# Altium schematic sheet Mynd_UI.SchDoc: Mynd-UI
size A3; Revision: 3.2; SheetNumber: 1; SheetTotal: 1
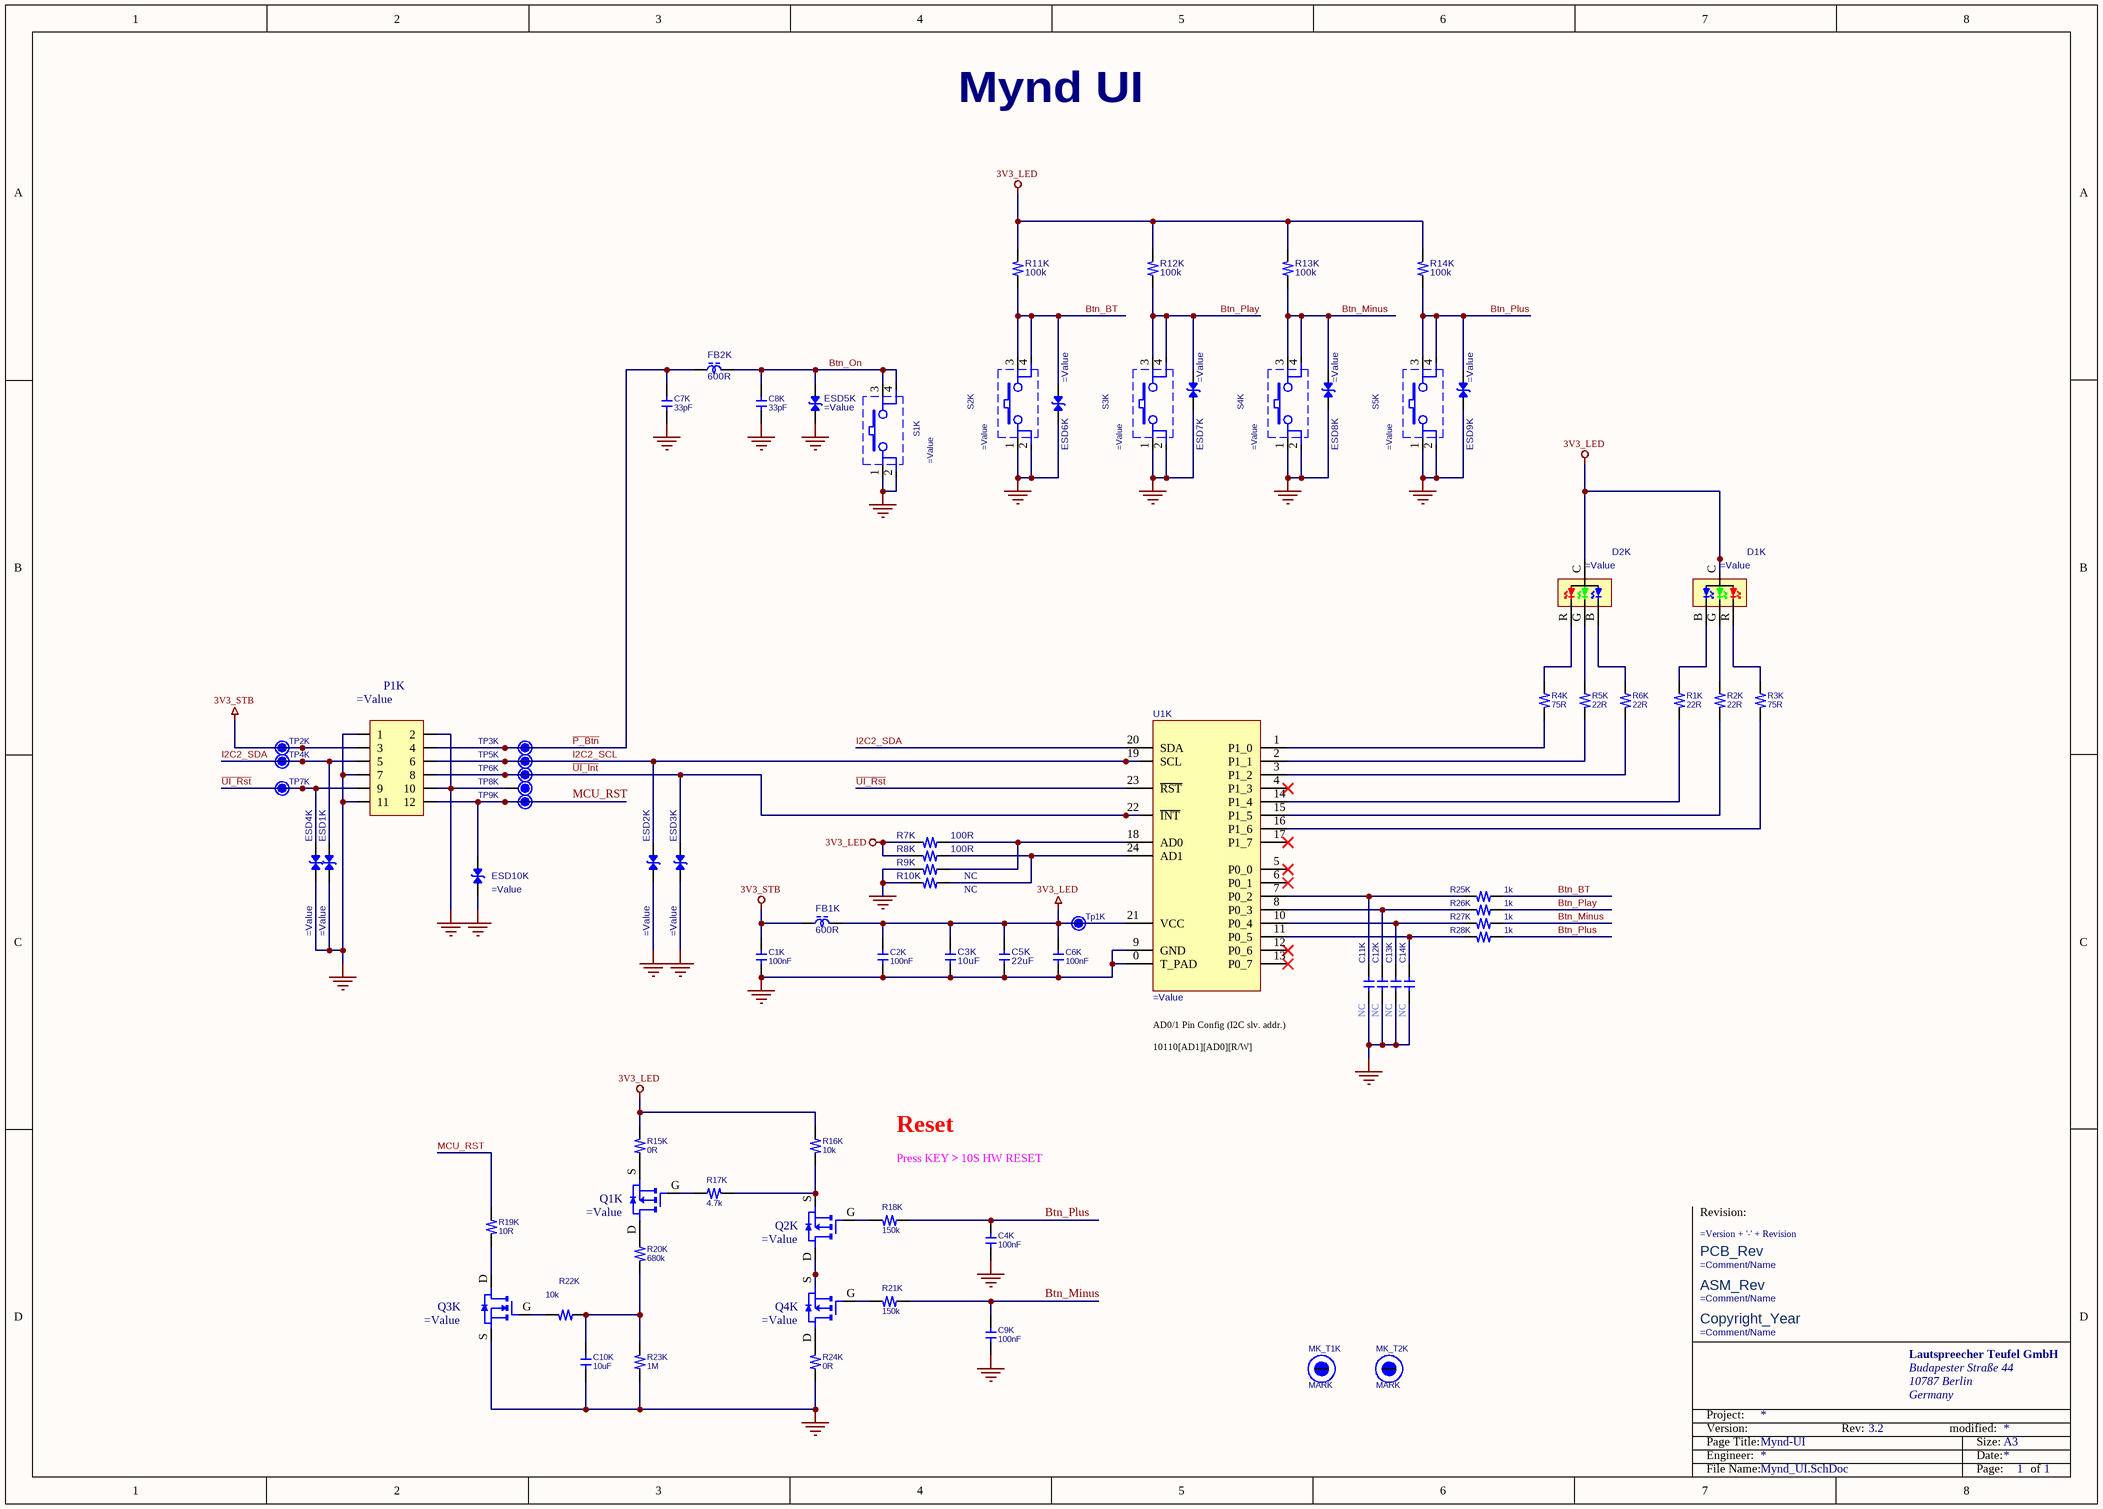
[diagram p0: Mynd_UI.SchDoc]

## Parts
C1K  100nF  [C0603X100]
C2K  100nF  [C0603X100]
C3K  10uF  [C0805_145]
C4K  100nF  [C0603X100]
C5K  22uF  [C1206]
C6K  100nF  [C0603X100]
C7K  33pF  [C0603X80]
C8K  33pF  [C0603X80]
C9K  100nF  [C0603X100]
C10K  10uF  [C0805_145]
C11K  NC  [C0603X100]  (value not drawn)
C12K  NC  [C0603X100]  (value not drawn)
C13K  NC  [C0603X100]  (value not drawn)
C14K  NC  [C0603X100]  (value not drawn)
D1K  (no value)  [LED_SMD_F_T_160X80X60]
D2K  (no value)  [LED_SMD_F_T_160X80X60]
ESD1K  (no value)  [DFN2_100X60X50_65]
ESD2K  (no value)  [DFN2_100X60X50_65]
ESD3K  (no value)  [DFN2_100X60X50_65]
ESD4K  (no value)  [DFN2_100X60X50_65]
ESD5K  (no value)  [DFN2_100X60X50_65]
ESD6K  (no value)  [DFN2_100X60X50_65]
ESD7K  (no value)  [DFN2_100X60X50_65]
ESD8K  (no value)  [DFN2_100X60X50_65]
ESD9K  (no value)  [DFN2_100X60X50_65]
ESD10K  (no value)  [DFN2_100X60X50_65]
FB1K  600R  [L0603]
FB2K  600R  [L0603]
MK_T1K  MARK  [MARK]  (no BOM)
MK_T2K  MARK  [MARK]  (no BOM)
P1K  (no value)  [WB200AL_2x6P]
Q1K  (no value)  [SOT23-GSD]
Q2K  (no value)  [SOT23-GSD]
Q3K  (no value)  [SOT23-GSD]
Q4K  (no value)  [SOT23-GSD]
R1K  22R  [R0603]
R2K  22R  [R0603]
R3K  75R  [R0603]
R4K  75R  [R0603]
R5K  22R  [R0603]
R6K  22R  [R0603]
R7K  100R  [R0603]
R8K  100R  [R0603]
R9K  10k  [R0603]  (value not drawn)
R10K  10k  [R0603]  (value not drawn)
R11K  100k  [R0603]
R12K  100k  [R0603]
R13K  100k  [R0603]
R14K  100k  [R0603]
R15K  0R  [R0603]
R16K  10k  [R0603]
R17K  4.7k  [R0603]
R18K  150k  [R0603]
R19K  10R  [R0603]
R20K  680k  [R0603]
R21K  150k  [R0603]
R22K  10k  [R0603]
R23K  1M  [R0603]
R24K  0R  [R0603]
R25K  1k  [R0603]
R26K  1k  [R0603]
R27K  1k  [R0603]
R28K  1k  [R0603]
S1K  (no value)  [TACT_SW_SMD_52X52X15]
S2K  (no value)  [TACT_SW_SMD_52X52X15]
S3K  (no value)  [TACT_SW_SMD_52X52X15]
S4K  (no value)  [TACT_SW_SMD_52X52X15]
S5K  (no value)  [TACT_SW_SMD_52X52X15]
Teufel_ASM_Label1K  (no value)  [Teufel_ASM_Rev]  (no BOM)
Teufel_Copyright1K  (no value)  [TEUFEL_COPYRIGHT]  (no BOM)
Teufel_PCB_Label1K  (no value)  [Teufel_PCB_Rev]  (no BOM)
Teufel_PCB_Logo1K  (no value)  [Teufel_NoLogo]  (no BOM)
Tp1K  TP_T_60_40  [TP_T_60_40]  (value not drawn)  (no BOM)
TP2K  TP12  [TP120]  (value not drawn)  (no BOM)
TP3K  TP12  [TP120]  (value not drawn)  (no BOM)
TP4K  TP12  [TP120]  (value not drawn)  (no BOM)
TP5K  TP12  [TP120]  (value not drawn)  (no BOM)
TP6K  TP12  [TP120]  (value not drawn)  (no BOM)
TP7K  TP12  [TP120]  (value not drawn)  (no BOM)
TP8K  TP12  [TP120]  (value not drawn)  (no BOM)
TP9K  TP12  [TP120]  (value not drawn)  (no BOM)
U1K  (no value)  [QFN24_400X400X100_50_P270X270]

## Nets
3V3_LED: C2K.1 C3K.1 C5K.2 C6K.2 D1K.C D2K.C FB1K.1 R7K.2 R8K.2 R11K.1 R12K.1 R13K.1 R14K.1 R15K.1 R16K.2 Tp1K.1 U1K.21(VCC)
3V3_STB: C1K.1 FB1K.2 P1K.3 TP2K.1
GND: C1K.2 C2K.2 C3K.2 C4K.2 C5K.1 C6K.1 C7K.2 C8K.2 C9K.2 C10K.2 C11K.2 C12K.2 C13K.2 C14K.2 ESD1K.1 ESD2K.1 ESD3K.1 ESD4K.1 ESD5K.1 ESD6K.1 ESD7K.1 ESD8K.1 ESD9K.1 ESD10K.1 P1K.1 P1K.2 P1K.7 P1K.10 P1K.11 Q3K.S R9K.2 R10K.2 R23K.1 R24K.1 S1K.1 S1K.2 S2K.1 S2K.2 S3K.1 S3K.2 S4K.1 S4K.2 S5K.1 S5K.2 TP8K.1 U1K.0(T_PAD) U1K.9(GND)
~{P_Btn}: C7K.1 FB2K.1 P1K.4 TP3K.1
~{UI_Int}: ESD3K.2 P1K.8 TP6K.1 U1K.22(~{INT})
~{UI_Rst}: ESD4K.2 P1K.9 TP7K.1 U1K.23(~{RST})
Btn_BT: ESD6K.2 R11K.2 R25K.2 S2K.3 S2K.4
Btn_Minus: C9K.1 ESD8K.2 R13K.2 R21K.1 R27K.2 S4K.3 S4K.4
Btn_On: C8K.1 ESD5K.2 FB2K.2 S1K.3 S1K.4
Btn_Play: ESD7K.2 R12K.2 R26K.2 S3K.3 S3K.4
Btn_Plus: C4K.1 ESD9K.2 R14K.2 R18K.1 R28K.2 S5K.3 S5K.4
I2C2_SCL: ESD2K.2 P1K.6 TP5K.1 U1K.19(SCL)
I2C2_SDA: ESD1K.2 P1K.5 TP4K.1 U1K.20(SDA)
MCU_RST: ESD10K.2 P1K.12 R19K.1 TP9K.1
NetC10K_1: C10K.1 R20K.2 R22K.1 R23K.2
NetC11K_1: C11K.1 R25K.1 U1K.7(P0_2)
NetC12K_1: C12K.1 R26K.1 U1K.8(P0_3)
NetC13K_1: C13K.1 R27K.1 U1K.10(P0_4)
NetC14K_1: C14K.1 R28K.1 U1K.11(P0_5)
NetD1K_B: D1K.B R1K.1
NetD1K_G: D1K.G R2K.1
NetD1K_R: D1K.R R3K.1
NetD2K_B: D2K.B R6K.1
NetD2K_G: D2K.G R5K.1
NetD2K_R: D2K.R R4K.1
NetQ1K_D: Q1K.D R20K.1
NetQ1K_G: Q1K.G R17K.2
NetQ1K_S: Q1K.S R15K.2
NetQ2K_D: Q2K.D Q4K.S
NetQ2K_G: Q2K.G R18K.2
NetQ2K_S: Q2K.S R16K.1 R17K.1
NetQ3K_D: Q3K.D R19K.2
NetQ3K_G: Q3K.G R22K.2
NetQ4K_D: Q4K.D R24K.2
NetQ4K_G: Q4K.G R21K.2
NetR1K_2: R1K.2 U1K.14(P1_4)
NetR2K_2: R2K.2 U1K.15(P1_5)
NetR3K_2: R3K.2 U1K.16(P1_6)
NetR4K_2: R4K.2 U1K.1(P1_0)
NetR5K_2: R5K.2 U1K.2(P1_1)
NetR6K_2: R6K.2 U1K.3(P1_2)
NetR7K_1: R7K.1 R9K.1 U1K.18(AD0)
NetR8K_1: R8K.1 R10K.1 U1K.24(AD1)

Not connected (* = marked no-connect by the designer): MK_T1K MK_B MK_T; MK_T2K MK_B MK_T; U1K 4(P1_3)* 5(P0_0)* 6(P0_1)* 12(P0_6)* 13(P0_7)* 17(P1_7)*

## Notes on the sheet
- Mynd UI
- NC
- AD0/1 Pin Config (I2C slv. addr.)
  10110[AD1][AD0][R/W]
- Reset
- Press KEY＞10S HW RESET
- Revision:
- Lautspreecher Teufel GmbH
- Budapester Straße 44
- 10787 Berlin
- Germany
- Page Title:
- Engineer:
- Project:
- Version:
- Rev:
- modified:
- Date:
- Size:
- A3
- File Name:
- Page:
- of
- (in symbol CMP-00086-3) Copyright_Year
- (in symbol CMP-00087-3) PCB_Rev
- (in symbol CMP-00088-3) ASM_Rev

## Library data of the parts
C1K C2K C4K C6K C9K C11K C12K C13K C14K = P-001-0038-28: GPHF SMD M CAP 100nF 16V ±10%  0603 X7R; Manufacturer: Multi-Sourced; Part_Number: Generic; Part_Type: Capacitor ceramic SMT; Tolerance: ±10%; Voltage: 16V; Temp_Coefficient: X7R
  C1K C2K C4K C6K C9K: Value: 100nF
  C11K C12K C13K C14K: Value: NC
C3K = P-001-0158-27: PSHF SMD M CAP 10uF 16V ±10% 0805 X7R; Manufacturer: Multi-Sourced; Part_Number: Generic; Part_Type: Capacitor ceramic SMT; Tolerance: ±10% 0805; Voltage: 16V; Temp_Coefficient: X7R; Value: 10uF
C5K = P-001-0179-36: PSHF SMD M CAP 22uF 16V ±10% 1206 X5R; Manufacturer: Multi-Sourced; Part_Number: Generic; Part_Type: Capacitor ceramic SMT; Tolerance: ±10%; Voltage: 16V; Temp_Coefficient: X5R; Value: 22uF
C7K C8K = P-001-0394-18: PSHF SMD M CAP 33pF 50V ±5% 0603 NPO; Manufacturer: Multi-Sourced; Part_Number: Generic; Part_Type: Capacitor ceramic SMT; Tolerance: ±5%; Voltage: 50V; Temp_Coefficient: NPO; Value: 33pF
C10K = P-001-0150-56: PSHF SMD M CAP 10uF 10V ±10% 0805 X5R; Manufacturer: Multi-Sourced; Part_Number: Generic; Part_Type: Capacitor ceramic SMT; Voltage: 10V; Tolerance: ±10%; Temp_Coefficient: X5R; Value: 10uF
D1K D2K = K-001-0100-16: SMD LED 4P 30mA RED&GN&BU; Manufacturer: MINGSHUO; Part_Number: JH-CRGBB06GTP014; Part_Type: Semiconductor LED RGB SMT; Color: Red/Green/Blue; Value: JH-CRGBB06GTP014; Current: 30mA
ESD1K ESD2K ESD3K ESD4K ESD6K ESD7K ESD8K ESD9K ESD10K = R-001-1582-2: SMD TVS 2P 5.5 DFN1006 CESD0501CU CTE; Part_Type: Semiconductor Diode TVS SMT; Voltage: 5.5V; Manufacturer: CTE; Part_Number: CESD0501CU; Value: CESD0501CU
ESD5K = R-001-1347-2: SMD TVS 2P DFN1006 BDFN2C121V; Manufacturer: []; Part_Type: Semiconductor Diode TVS SMT; Part_Number: BDFN2C121V; Value: BDFN2C121V
FB1K FB2K = S-001-0006-21: PS SMD FERRITE BEAD 600OHM 25% 0603; Manufacturer: [TSA]; Part_Number: FCM1608KF-601T05; Part_Type: Ferrite Bead SMT; Current: 0.5A; Tolerance: 1:25%; Frequency: 100MHz; Value: 600R
MK_T1K MK_T2K = N-001-00003-2: MARK DOT; Design Item ID: MARK
P1K = C-001-1264-2: SMD WTB CONNECTOR 12P P2.0mm TIN; Manufacturer: MINGHENG; Part_Number: WB200AL-12; Part_Type: Connector 2 x 6P; Value: WB200AL-12; System: Connector
Q1K Q2K Q4K = R-001-1323-5: GPHF SMD FET 3P -30V SOT-23 CJ3401 CJ; Part_Type: Semiconductor Transistor SMT; Current: -4.2V; Voltage: -30; Manufacturer: CJ; Part_Number: CJ3401; Value: CJ3401
Q3K = R-001-0217-30: GP SMD FET 3P SOT23 2N7002K CTE; Part_Type: Semiconductor Transistor SMT; Current: 300MA; Voltage: 60V; Manufacturer: CTE; Part_Number: 2N7002K; Value: 2N7002K
R1K R2K R5K R6K = Q-001-0242-31: PS SMD RES. 22OHM 1/10W 5% 0603; Manufacturer: Multi-Sourced; Part_Number: Generic; Part_Type: Resistor SMT; Temp_Coefficient: 150ppm; Tolerance: 5%; Wattage: 1/10W; Value: 22R
R3K R4K = Q-001-0024-21: PS SMD RES. 75OHM 1/10W 1% 0603; Manufacturer: Multi-Sourced; Part_Number: Generic; Part_Type: Resistor SMT; Temp_Coefficient: 150ppm; Tolerance: 1%; Wattage: 1/10W; Value: 75R
R7K R8K = Q-001-0256-20: PS SMD RES. 100OHM 1/10W 1% 0603; Part_Type: Resistor SMT; Manufacturer: Multi-Sourced; Part_Number: Generic; Temp_Coefficient: 150ppm; Tolerance: 1%; Value: 100R; Wattage: 1/10W
R9K R10K = Q-001-0036-48: PS SMD RES. 10KOHM 1/10W 1% 0603; Manufacturer: Multi-Sourced; Part_Number: Generic; Part_Type: Resistor SMT; Temp_Coefficient: 150ppm; Tolerance: 1%; Wattage: 1/10W; Value: 10k
R11K R12K R13K R14K = Q-001-0032-53: PS SMD RES. 100KOHM 1/10W 1% 0603; Part_Type: Resistor SMT; Manufacturer: Multi-Sourced; Part_Number: Generic; Temp_Coefficient: 150ppm; Tolerance: 1%; Value: 100k; Wattage: 1/10W
R15K R24K = Q-001-0048-204: GPHF SMD RES. 0OHM 1/10W 5% 0603; Manufacturer: Multi-Sourced; Part_Number: Generic; Part_Type: Resistor SMT; Temp_Coefficient: 150ppm; Tolerance: 5%; Wattage: 1/10W; Value: 0R
R16K R22K = Q-001-0058-52: GPHF SMD RES. 10KOHM 1/10W 5% 0603; Manufacturer: Multi-Sourced; Part_Number: Generic; Part_Type: Resistor SMT; Temp_Coefficient: 150ppm; Tolerance: 5%; Wattage: 1/10W; Value: 10k
R17K = Q-001-0077-41: GPHF SMD RES. 4.7KOHM 1/10W 5% 0603; Manufacturer: Multi-Sourced; Part_Number: Generic; Part_Type: Resistor SMT; Temp_Coefficient: 150ppm; Tolerance: 5%; Wattage: 1/10W; Value: 4.7k
R18K R21K = Q-001-0222-26: GPHF SMD RES. 150KOHM 1/10W 5% 0603; Manufacturer: Multi-Sourced; Part_Number: Generic; Part_Type: Resistor SMT; Temp_Coefficient: 150ppm; Tolerance: 5%; Wattage: 1/10W; Value: 150k
R19K = Q-001-0043-26: GPHF SMD RES. 10OHM 1/10W 1% 0603; Manufacturer: Multi-Sourced; Part_Number: Generic; Part_Type: Resistor SMT; Temp_Coefficient: 150ppm; Tolerance: 1%; Wattage: 1/10W; Value: 10R
R20K = Q-001-0105-21: GPHF SMD RES. 680KOHM 1/10W 5% 0603; Manufacturer: Multi-Sourced; Part_Number: Generic; Part_Type: Resistor SMT; Temp_Coefficient: 150ppm; Tolerance: 5%; Wattage: 1/10W; Value: 680k
R23K = Q-001-0062-26: GPHF $ SMD RES. 1MOHM 1/10W 5% 0603; Manufacturer: Multi-Sourced; Part_Number: Generic; Part_Type: Resistor SMT; Temp_Coefficient: 150ppm; Tolerance: 5%; Wattage: 1/10W; Value: 1M
R25K R26K R27K R28K = Q-001-0033-29: GPHF SMD RES. 1KOHM 1/10W 1% 0603; Manufacturer: Multi-Sourced; Part_Number: Generic; Part_Type: Resistor SMT; Temp_Coefficient: 150ppm; Tolerance: 1%; Wattage: 1/10W; Value: 1k
S1K S2K S3K S4K S5K = M-001-0057-2: SMD SWITCH 4P TC-1316A-H1.5-180G; Manufacturer: [MINGHENG]; Part_Number: TC-1316A-H1.5-180GF; Part_Type: Tact Switch SMT; Value: TC-1316A-H1.5-180GF
Teufel_ASM_Label1K = CMP-00088-3: Teufel_ASM_Rev
Teufel_Copyright1K = CMP-00086-3: Teufel_Copyright_Year
Teufel_PCB_Label1K = CMP-00087-3: Teufel_PCB_Label
Teufel_PCB_Logo1K = Teufel NoLogo: Teufel PCB NoLogo
Tp1K = CMP-00089-1: Test Point; Design Item ID: TP
TP2K TP3K TP4K TP5K TP6K TP7K TP8K TP9K = N-001-00010-2: Test Point; Design Item ID: TP
U1K = R-001-0966-163: GP SMD IC 24P TQFN AW9523BTQR AWINIC; Part_Type: Semiconductor Integrated Circuit SMT; Manufacturer: AWINIC; Part_Number: AW9523BTQR; Value: AW9523BTQR